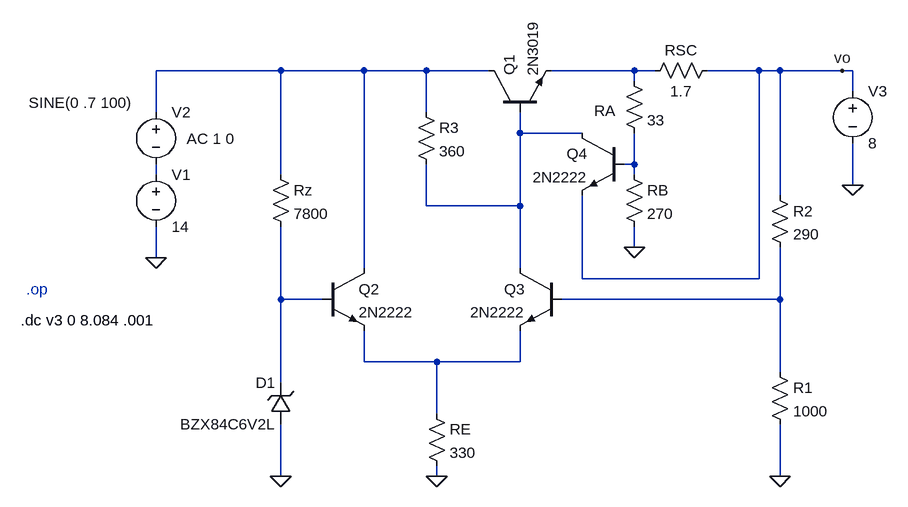
[diagram p0: schematic regulador2.asc]
regulador2.asc, the LTspice schematic file:
Version 4
SHEET 1 1316 680
WIRE 224 -48 32 -48
WIRE 352 -48 224 -48
WIRE 448 -48 352 -48
WIRE 544 -48 448 -48
WIRE 768 -48 640 -48
WIRE 800 -48 768 -48
WIRE 960 -48 880 -48
WIRE 992 -48 960 -48
WIRE 1088 -48 992 -48
WIRE 1104 -48 1088 -48
WIRE 768 -32 768 -48
WIRE 1104 -16 1104 -48
WIRE 32 16 32 -48
WIRE 448 16 448 -48
WIRE 592 48 592 16
WIRE 688 48 592 48
WIRE 768 96 768 48
WIRE 768 96 752 96
WIRE 32 112 32 96
WIRE 224 112 224 -48
WIRE 768 112 768 96
WIRE 1104 128 1104 64
WIRE 992 144 992 -48
WIRE 448 160 448 96
WIRE 592 160 592 48
WIRE 592 160 448 160
WIRE 768 224 768 192
WIRE 32 240 32 192
WIRE 352 256 352 -48
WIRE 592 256 592 160
WIRE 688 272 688 144
WIRE 960 272 960 -48
WIRE 960 272 688 272
WIRE 224 304 224 192
WIRE 288 304 224 304
WIRE 992 304 992 224
WIRE 992 304 656 304
WIRE 352 400 352 352
WIRE 464 400 352 400
WIRE 592 400 592 352
WIRE 592 400 464 400
WIRE 992 416 992 304
WIRE 224 432 224 304
WIRE 464 480 464 400
WIRE 224 576 224 496
WIRE 464 576 464 560
WIRE 992 576 992 496
FLAG 32 240 0
FLAG 464 576 0
FLAG 224 576 0
FLAG 992 576 0
FLAG 1104 128 0
FLAG 1088 -48 vo
FLAG 768 224 0
DATAFLAG 992 -48 ""
DATAFLAG 448 -48 ""
DATAFLAG 464 400 ""
DATAFLAG 992 304 ""
DATAFLAG 224 304 ""
SYMBOL voltage 32 96 R0
WINDOW 123 0 0 Left 2
WINDOW 39 0 0 Left 2
SYMATTR InstName V1
SYMATTR Value 14
SYMBOL voltage 32 0 R0
WINDOW 123 47 57 Left 2
WINDOW 39 0 0 Left 2
WINDOW 3 -196 1 Left 2
SYMATTR Value2 AC 1 0
SYMATTR Value SINE(0 .7 100)
SYMATTR InstName V2
SYMBOL npn 544 16 R270
SYMATTR InstName Q1
SYMATTR Value 2N3019
SYMBOL npn 288 256 R0
SYMATTR InstName Q2
SYMATTR Value 2N2222
SYMBOL npn 656 256 M0
SYMATTR InstName Q3
SYMATTR Value 2N2222
SYMBOL res 432 0 R0
SYMATTR InstName R3
SYMATTR Value 360
SYMBOL res 448 464 R0
SYMATTR InstName RE
SYMATTR Value 330
SYMBOL res 208 96 R0
SYMATTR InstName Rz
SYMATTR Value 7800
SYMBOL zener 240 496 R180
WINDOW 0 24 64 Left 2
WINDOW 3 24 0 Left 2
SYMATTR InstName D1
SYMATTR Value BZX84C6V2L
SYMATTR Description Diode
SYMATTR Type diode
SYMBOL res 976 128 R0
SYMATTR InstName R2
SYMATTR Value 290
SYMBOL res 976 400 R0
SYMATTR InstName R1
SYMATTR Value 1000
SYMBOL npn 752 48 M0
SYMATTR InstName Q4
SYMATTR Value 2N2222
SYMBOL res 896 -64 R90
WINDOW 0 0 56 VBottom 2
WINDOW 3 32 56 VTop 2
SYMATTR InstName RSC
SYMATTR Value 1.7
SYMBOL res 752 -48 R0
WINDOW 0 -46 62 Left 2
SYMATTR InstName RA
SYMATTR Value 33
SYMBOL res 752 96 R0
SYMATTR InstName RB
SYMATTR Value 270
SYMBOL voltage 1104 -32 R0
WINDOW 123 0 0 Left 0
WINDOW 39 0 0 Left 0
SYMATTR InstName V3
SYMATTR Value 8
TEXT -168 288 Left 2 ;.op
TEXT -176 336 Left 2 !.dc v3 0 8.084 .001

The netlist it stands for:
* regulador2.asc
V1 N005 0 14
V2 N001 N005 SINE(0 .7 100) AC 1 0
Q1 N001 N003 N002 0 2N3019
Q2 N001 N006 N008 0 2N2222
Q3 N003 N007 N008 0 2N2222
R3 N001 N003 360
RE N008 0 330
Rz N001 N006 7800
D1 0 N006 BZX84C6V2L
R2 vo N007 290
R1 N007 0 1000
Q4 N003 N004 vo 0 2N2222
RSC vo N002 1.7
RA N002 N004 33
RB N004 0 270
V3 vo 0 8
.model D D
.lib standard.dio
.model NPN NPN
.model PNP PNP
.lib standard.bjt
* .op
.dc v3 0 8.084 .001
.backanno
.end